# Altium project SelfDrivingCar_Project.PrjPcb (part 1 of 2)
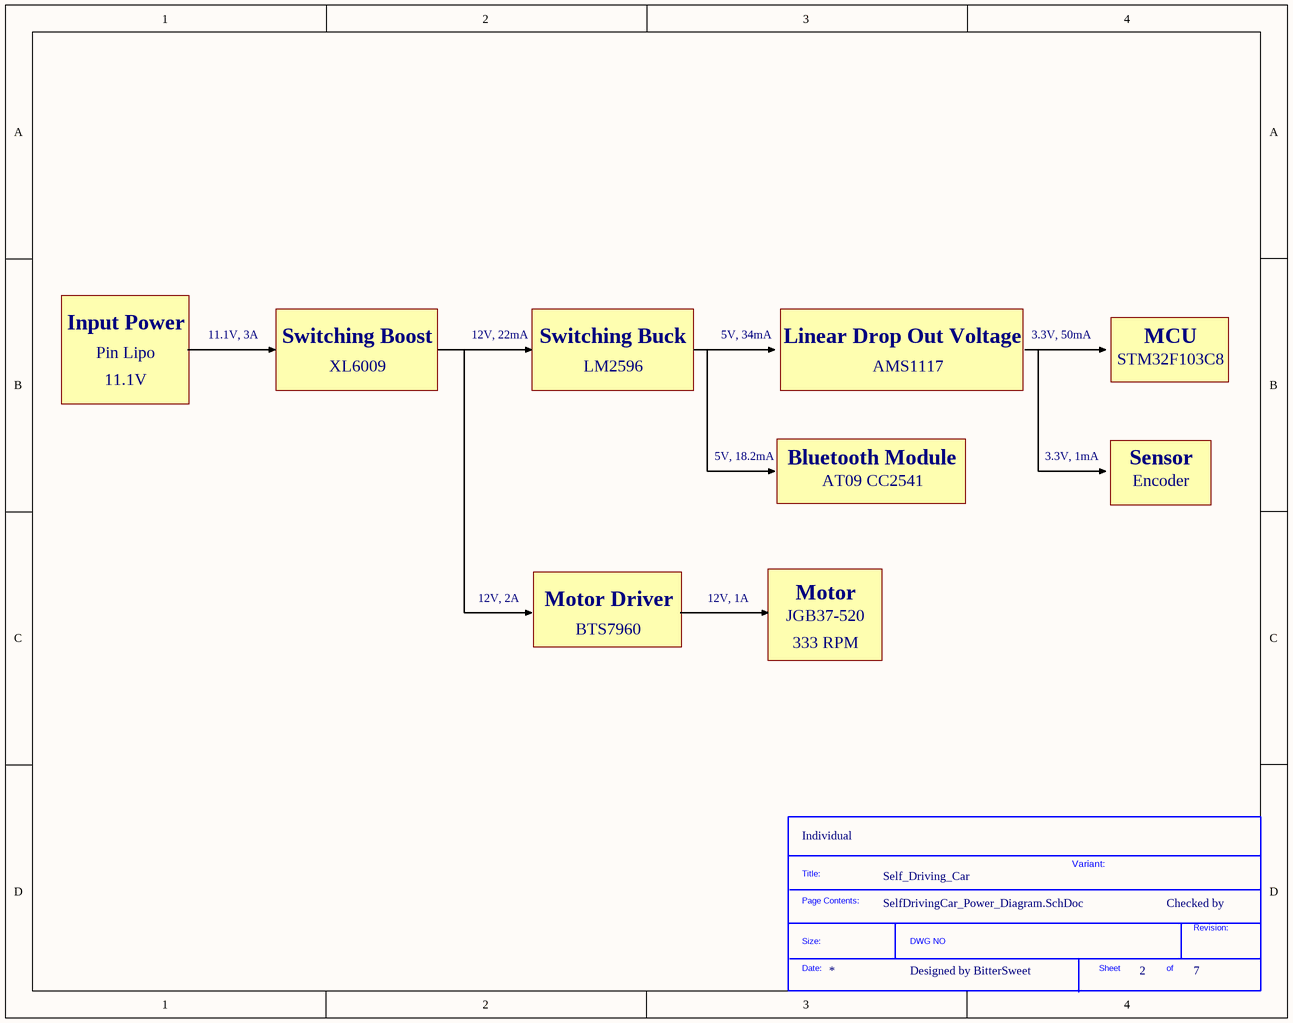
[diagram p0: SelfDrivingCar_Power_Diagram.SchDoc]
6 sheets, 141 parts. Net scope: flat (ports and power ports of the same name join across sheets).
Board file: SelfDrivingCar_PCB.PcbDoc
Sheets:
  SelfDrivingCar_Power_Diagram.SchDoc
  SelfDrivingCar_SCH_PowerBoard.SchDoc
  SelfDrivingCar_SCH_STM32F103C8T6.SchDoc
  SelfDrivingCar_SCH_MotorDriver.SchDoc
  SelfDrivingCar_SCH_Others.SchDoc
  SelfDrivingCar_SCH_Total.SchDoc

## Sheet SelfDrivingCar_Power_Diagram.SchDoc
size A; DocumentNumber: 3; SheetNumber: 2; SheetTotal: 7

### Parts
(Parts that share a designator on the sheet are numbered #1, #2 ... from top to bottom, then left to right.)
*?#1  SDTitleBlock  (value not drawn)  (graphical)

### Notes on the sheet
- Input Power
- Pin Lipo
- 11.1V, 3A
- Switching Boost
- XL6009
- 12V, 22mA
- Switching Buck
- LM2596
- 5V, 34mA
- Linear Drop Out Voltage
- AMS1117
- 3.3V, 50mA
- STM32F103C8
- MCU
- 11.1V
- 5V, 18.2mA
- Bluetooth Module
- AT09 CC2541
- 3.3V, 1mA
- Sensor
- Encoder
- 12V, 2A
- Motor Driver
- BTS7960
- 12V, 1A
- JGB37-520
- Motor
- 333 RPM
- (near *?#1) Individual
- Self_Driving_Car
- Variant:
- Checked by
- Designed by BitterSweet
- (in symbol SDTitleBlock) Title:; Page Contents:; Revision:; Size:; DWG NO; Date:; Sheet; of

## Sheet SelfDrivingCar_SCH_PowerBoard.SchDoc: Power Distribution Schematic
size A; DocumentNumber: Power Distribution Schematic; SheetNumber: 3; SheetTotal: 7
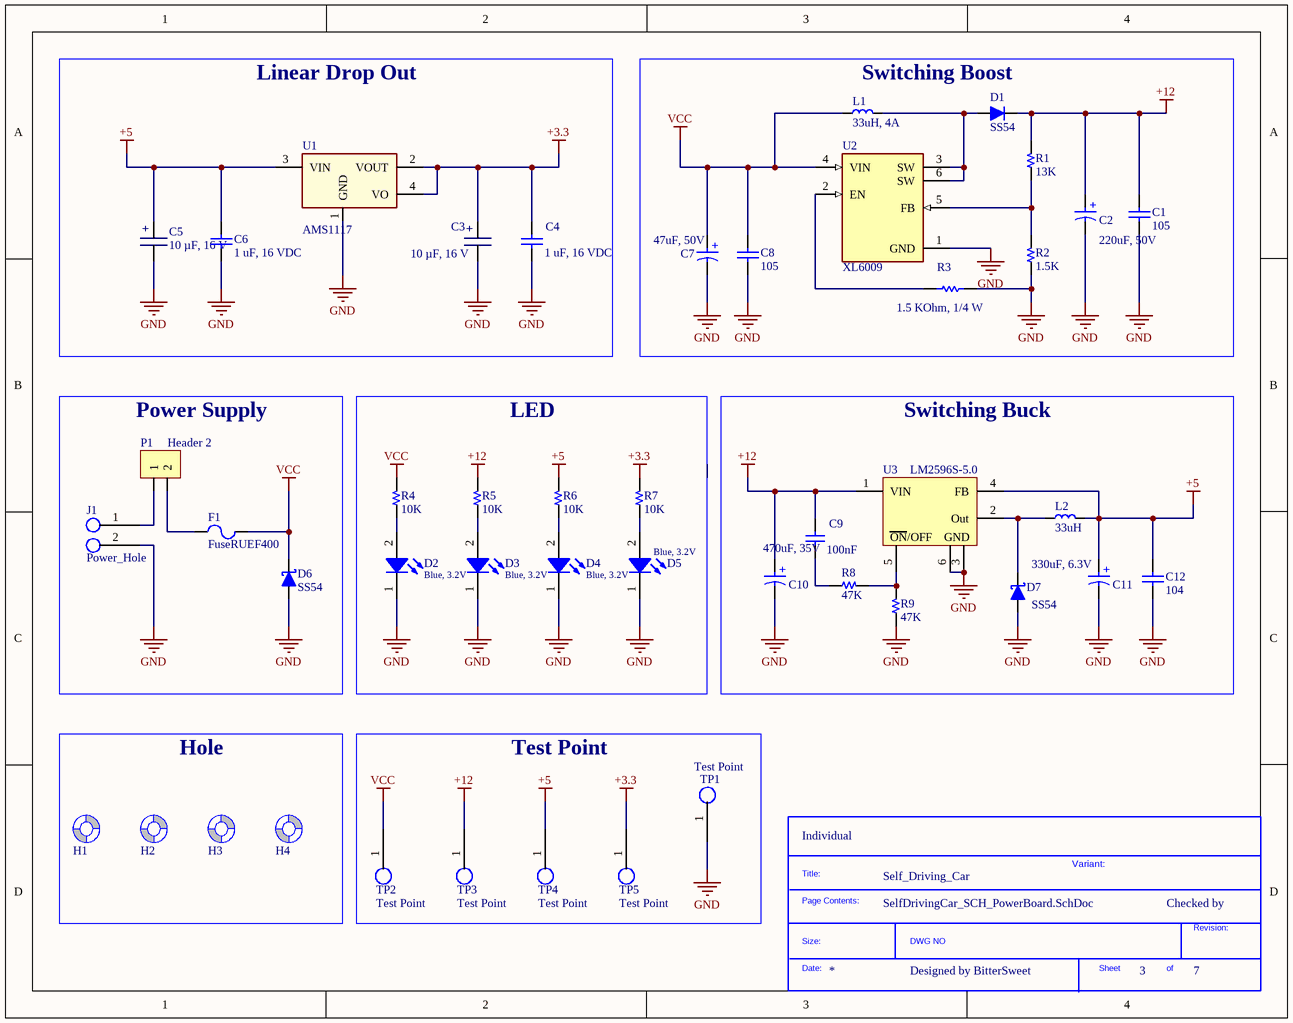
[diagram p1: SelfDrivingCar_SCH_PowerBoard.SchDoc]

### Parts
(Parts that share a designator on the sheet are numbered #1, #2 ... from top to bottom, then left to right.)
*?#2  SDTitleBlock  (value not drawn)  (graphical)
C1  105  [tu 1206]
C2  220uF, 50V  [WCAP-ASLI_D10H10.5]
C3  10 µF, 16 V  [TANTALUM SMD A]
C4  1 uF, 16 VDC  [CAP_0603]
C5  10 µF, 16 V  [TANTALUM SMD A]
C6  1 uF, 16 VDC  [CAP_0603]
C7  47uF, 50V  [WCAP-ASLI_D6.3H7.7]
C8  105  [tu 1206]
C9  100nF  [C 0805]
C10  470uF, 35V  [WCAP-ASLI_D10H10.5]
C11  330uF, 6.3V  [WCAP-ASLI_D6.3H7.7]
C12  104  [tu 0805]
D1  SS54  [DO-214AB (SMC)]
D2  Blue, 3.2V  [WL-SMCW_0805]
D3  Blue, 3.2V  [WL-SMCW_0805]
D4  Blue, 3.2V  [WL-SMCW_0805]
D5  Blue, 3.2V  [WL-SMCW_0805]
D6  SS54  [DO-214AC (SMA)]
D7  SS54  [DO-214AC (SMA)]
F1  FuseRUEF400  [FuseRUEF400]
H1  Screw Hole  [SCREW/3.2/7.0/M]  (value not drawn)  (no BOM)
H2  Screw Hole  [SCREW/3.2/7.0/M]  (value not drawn)  (no BOM)
H3  Screw Hole  [SCREW/3.2/7.0/M]  (value not drawn)  (no BOM)
H4  Screw Hole  [SCREW/3.2/7.0/M]  (value not drawn)  (no BOM)
J1  Power_Hole  [Power_Hole_2mm_THT]
L1  33uH, 4A  [Inductor SMD 12x12x8]
L2  33uH  [Inductor SMD 12x12x8]
P1  Header 2  [HDR/Terminal/2/3.5mm]
R1  13K  [R 0603]
R2  1.5K  [R 0603]
R3  1.5 KOhm, 1/4 W  [resistor_0603]
R4  10K  [R 0603]
R5  10K  [R 0603]
R6  10K  [R 0603]
R7  10K  [R 0603]
R8  47K  [R 0603]
R9  47K  [R 0603]
TP1  Test Point  [TP_1_5mm_SMD]
TP2  Test Point  [TP_1_5mm_SMD]
TP3  Test Point  [TP_1_5mm_SMD]
TP4  Test Point  [TP_1_5mm_SMD]
TP5  Test Point  [TP_1_5mm_SMD]
U1  AMS1117  [SOT-223]
U2  XL6009  [XL6009]
U3  LM2596S-5.0  [TO-263-5]

### Blocks framed on the sheet
Linear Drop Out: C3-C6 U1
Switching Boost: C1 C2 C7 C8 D1 L1 R1-R3 U2
Power Supply: D6 F1 J1 P1
LED: D2-D5 R4-R7
Switching Buck: C9-C12 D7 L2 R8 R9 U3
Hole: H1-H4
Test Point: TP1-TP5

### Nets
+3.3: C3.2 C4.2 R7.2 TP5.1 U1.2(VOUT) U1.4(VO)
+5: C5.2 C6.2 C11.1(P) C12.1 L2.2 R6.2 TP4.1 U1.3(VIN) U3.4(FB)
+12: C1.1 C2.1(P) C9.1 C10.1(P) D1.2(K) R1.2 R5.2 TP3.1 U3.1(VIN)
GND: C1.2 C2.2(N) C3.1 C4.1 C5.1 C6.1 C7.2(N) C8.2 C10.2(N) C11.2(N) C12.2 D2.1(K) D3.1(K) D4.1(K) D5.1(K) D6.1(A) D7.1(A) J1.2 R2.1 R3.2 R9.1 TP1.1 U1.1(GND) U2.1(GND) U3.3(GND) U3.6(PAD)
VCC: C7.1(P) C8.1 D6.2(K) F1.2 L1.1 R4.2 TP2.1 U2.4(VIN)
NetC9_2: C9.2 R8.1
NetD1_1: D1.1(A) L1.2 U2.3(SW) U2.6(SW)
NetD2_2: D2.2(A) R4.1
NetD3_2: D3.2(A) R5.1
NetD4_2: D4.2(A) R6.1
NetD5_2: D5.2(A) R7.1
NetD7_2: D7.2(K) L2.1 U3.2(Out)
NetF1_1: F1.1 P1.2
NetJ1_1: J1.1 P1.1
NetR1_1: R1.1 R2.2 U2.5(FB)
NetR3_1: R3.1 U2.2(EN)
NetR8_2: R8.2 R9.2 U3.5(~{ON}/OFF)

Not connected (* = marked no-connect by the designer): H1 1(Screw); H2 1(Screw); H3 1(Screw); H4 1(Screw)

### Notes on the sheet
- (near *?#2) Individual
- Self_Driving_Car
- Variant:
- Checked by
- Designed by BitterSweet
- (in symbol 01120610610) +
- (in symbol 865080145010) +
- (in symbol 865080645012) +
- (in symbol 865080657018) +
- (in symbol 0710101508650801570160U20) +
- (in symbol LM2596S-5.0) ON/OFF
- (in symbol SDTitleBlock) Title:; Page Contents:; Revision:; Size:; DWG NO; Date:; Sheet; of

### Library data of the parts
C1 C8 = Tu 1206 105 50V 20%: Dán; Don_Vi: Con; So_Chan: 2; Ten_Linh_Kien: Tụ 1206 105-1uF 10% 16V; Ma_Hang: MH004545; Chung_Loai: Dán; Kieu_Chan: *; ComponentLink1Description: URL; ComponentLink1URL: https://www.thegioiic.com/tu-gom-1206-1uf-16v; SUPPLIER NAME: JLCPCB; SUPPLIER SN: C141215; SUPPLIER URL: https://jlcpcb.com/partdetail/Kemet-C1206X105K5RAC7800/C141215
C2 = 865080657018: V-Chip, D10 x H10.5mm, 220uF, 50V; Manufacturer: Wurth Elektronik; Capacitance Tolerance: +/-20%; Dissipation Factor: 12%; Endurance: 2000h; Leakage Current: 110uA; Ripple Current: 650mA; Category: Aluminum Electrolytic Capacitors; ComponentLink2Description: Datasheet Link; ComponentLink2URL: https://www.we-online.com/redexpert/spec/865080657018?ad; Mount: Surface Mount; Operating Temperature Max: 105°C; Operating Temperature Min: -55°C; Packaging: Tape and Reel; Height: 10.5mm; Diameter: 10mm; Capacitance: 220uF; Rated Voltage (DC): 50V; Supplier 1 Name: Mouser; Supplier 1 SN: 710-865080657018; Supplier 1 URL: https://www.mouser.vn/ProductDetail/Wurth-Elektronik/865080657018?qs=0KOYDY2FL28CcgHzg1XTuA%3D%3D; Supplier 3 Name: thegioiic; Supplier 3 URL: https://www.thegioiic.com/tu-nhom-smd-220uf-50v-10x10-5mm; Manufacturer Part Number: N/A; Supplier 2 Name: Digi-Key; Supplier 2 SN: N/A; Supplier 2 URL: N/A; Supplier 3 SN: N/A; Value: 220uF, 50V; ComponentLink3Description: URL; ComponentLink3URL: https://www.thegioiic.com/tu-nhom-smd-220uf-50v-10x10-5mm; SUPPLIER NAME: JLCPCB; SUPPLIER SN: C5289735; SUPPLIER URL: https://jlcpcb.com/partdetail/aishi_aihua_group-EMK1HM221GB0D00R/C5289735
C3 C5 = 01120610610: CAP TANT 10uF 10% 16V 1206; Manufacture  Name: KYOCERA AVX; Manufacture  SN: TPSA106K016R1000; Capacitance Tolerance: +/-10%; ComponentLink1Description: Datasheet link; ComponentLink1URL: https://datasheets.kyocera-avx.com/TAJ.pdf; ComponentLink2Description: Supplier 1 URL; ComponentLink2URL: https://www.mouser.vn/ProductDetail/KYOCERA-AVX/TPSA106K016R1000?qs=GLv2FRWg8zkKT7IxHlCjvQ%3D%3D; Size: 1206; Mounting Technology: SMT; Capacitance: 10uF; ComponentLink3Description: Supplier 2 URL; ComponentLink3URL: https://www.digikey.com/en/products/detail/kyocera-avx/TPSA106K016R1000/7536120; ComponentLink4Description: Supplier 3 URL; ComponentLink4URL: https://www.thegioiic.com/tu-tantalum-10uf-16v-1206-taja106k016rnj; Supplier 1 Name: Mouser; Supplier 1 SN: 581-TPSA106K016R1000; Supplier 1 URL: https://www.mouser.vn/ProductDetail/KYOCERA-AVX/TPSA106K016R1000?qs=GLv2FRWg8zkKT7IxHlCjvQ%3D%3D; Supplier 2 Name: Digi-Key; Supplier 2 SN: 478-10757-1-ND; Supplier 2 URL: https://www.digikey.com/en/products/detail/kyocera-avx/TPSA106K016R1000/7536120; Supplier 3 Name: thegioiic; Supplier 3 SN: N/A; Supplier 3 URL: https://www.thegioiic.com/tu-tantalum-10uf-16v-1206-taja106k016rnj; Value: 10 µF, 16 V; Rated Voltage: 16 V; ComponentLink5Description: URL; ComponentLink5URL: https://www.thegioiic.com/tu-tantalum-10uf-16v-1206-taja106k016rnj; SUPPLIER NAME: JLCPCB; SUPPLIER SN: C128857; SUPPLIER URL: https://jlcpcb.com/partdetail/Yageo-CC1206KKX5R7BB106/C128857
C4 C6 = 0106031051016: CAP, size 0603, 1 uF, 16 VDC; Manufacture Name: Samsung Electro-Mechanics; Manufacture SN: CL10B105KO8NNWC; Capacitance: 1 uF; Tolerance: +/-10%; Voltage Rating DC: 16 VDC; ComponentLink2Description: Datasheet; ComponentLink2URL: https://www.mouser.vn/datasheet/2/585/Samsung_MLCC_1837944-1929650.pdf; Operating Temperature: -55 to +125degC; Packaging: Tape and Reel; Mounting Technology: SMT; Size: 0603; Supplier 1 Name: Mouser; Supplier 1 SN: 187-CL10B105KO8NNWC; Supplier 1 URL: https://www.mouser.vn/ProductDetail/Samsung-Electro-Mechanics/CL10B105KO8NNWC?qs=81r%252BiQLm7BT%252BXtc72qn1ug%3D%3D&utm_source=mouser-refine-download&utm_medium=file&utm_campaign=CL10B105KO8NNWC&utm_content=Samsung-Electro-Mechanics; Supplier 2 Name: Digi-Key; Supplier 2 SN: 1276-CL10B105KO8NNWCTR-ND; Supplier 2 URL: https://www.digikey.com/en/products/detail/samsung-electro-mechanics/cl10b105ko8nnwc/16572783; Supplier 3 Name: thegioiic; Supplier 3 SN: N/A; Supplier 3 URL: https://www.thegioiic.com/tu-gom-0603-1uf-16v; Value: 1 uF, 16 VDC; SUPPLIER NAME: JLCPCB; SUPPLIER SN: C76706; SUPPLIER URL: https://jlcpcb.com/partdetail/Tdk-CGA3E1X7R1C105KT0Y0N/C76706
C7 = 865080645012: V-Chip, D6.3 x H7.7mm, 47uF, 50V; Manufacturer: Wurth Elektronik; Capacitance Tolerance: +/-20%; Dissipation Factor: 12%; Endurance: 2000h; Leakage Current: 23.5uA; Ripple Current: 230mA; Category: Aluminum Electrolytic Capacitors; ComponentLink2Description: Datasheet Link; ComponentLink2URL: https://www.thegioiic.com/tu-nhom-smd-47uf-50v-6-3x7-7mm; Mount: Surface Mount; Operating Temperature Max: 105°C; Operating Temperature Min: -55°C; Packaging: Tape and Reel; Height: 7.7mm; Diameter: 6.3mm; Capacitance: 47uF; Rated Voltage (DC): 50V; Supplier 1 Name: Mouser; Supplier 1 SN: 710-865080645012; Supplier 1 URL: https://www.mouser.vn/ProductDetail/Wurth-Elektronik/865080645012?qs=0KOYDY2FL2%252BvvLOdOSK4rA%3D%3D&_gl=1*1ey7vig*_ga*MTg2NTM2NjU1Mi4xNjkwOTM2MTU0*_ga_15W4STQT4T*MTY5MDkzNjE1NC4xLjAuMTY5MDkzNjE1Ny4wLjAuMA..*_ga_1KQLCYKRX3*MTY5MDkzNjE1NC4xLjAuMTY5MDkzNjE1Ny41Ny4wLjA.; Supplier 3 Name: thegioiic; Supplier 3 URL: https://www.thegioiic.com/tu-nhom-smd-47uf-50v-6-3x7-7mm; Manufacturer Part Number: N/A; Supplier 2 Name: Digi-Key; Supplier 2 SN: N/A; Supplier 2 URL: N/A; Supplier 3 SN: N/A; Value: 47uF, 50V; ComponentLink3Description: URL; ComponentLink3URL: https://www.thegioiic.com/tu-nhom-smd-47uf-50v-6-3x7-7mm; SUPPLIER NAME: JLCPCB; SUPPLIER SN: C445256; SUPPLIER URL: https://jlcpcb.com/partdetail/Nichicon-UUD1H470MCL1GS/C445256
C9 = Capacitor NP: Capacitor non-pol; ComponentLink1Description: URL; ComponentLink1URL: https://www.thegioiic.com/tu-gom-0603-100nf-0-1uf-50v; SUPPLIER NAME: JLCPCB; SUPPLIER SN: C779984; SUPPLIER URL: https://jlcpcb.com/partdetail/-08055C104K4Z2A/C779984
C10 = 0710101508650801570160U20: V-Chip, D10 x H10.5mm, 470uF, 35V; Manufacturer: Wurth Elektronik; Capacitance Tolerance: +/-20%; Dissipation Factor: 24%; Endurance: 2000h; Leakage Current: 94.5uA; Rated Voltage (DC): 6.3V; Ripple Current: 650mA; Category: Aluminum Electrolytic Capacitors; ComponentLink2Description: Datasheet Link; ComponentLink2URL: https://www.we-online.com/redexpert/spec/865080157016?ad; Mount: Surface Mount; Operating Temperature Max: 105°C; Operating Temperature Min: -55°C; Packaging: Tape and Reel; Height: 10.5mm; Diameter: 10mm; Capacitance: 470uF; Supplier 1 Name: Mouser; Supplier 1 SN: 710-865080157016; Supplier 1 URL: https://www.mouser.vn/ProductDetail/Wurth-Elektronik/865080157016?qs=0KOYDY2FL29k8EDLGk1i5Q%3D%3D; Supplier 3 Name: thegioiic; Supplier 3 URL: https://www.mouser.vn/ProductDetail/Wurth-Elektronik/865080157016?qs=0KOYDY2FL29k8EDLGk1i5Q%3D%3D; Manufacturer Part Number: N/A; Supplier 2 Name: Digi-Key; Supplier 2 SN: N/A; Supplier 2 URL: https://www.thegioiic.com/tu-nhom-smd-470uf-35v-10x10-5mm; Supplier 3 SN: N/A; Value: 470uF, 35V; SUPPLIER NAME: JLCPCB; SUPPLIER SN: C3039779; SUPPLIER URL: https://jlcpcb.com/partdetail/3595245-VT477M035GA5RR0NB1VP0/C3039779
C11 = 865080145010: V-Chip, D6.3 x H7.7mm, 330uF, 16V; Manufacturer: Wurth Elektronik; Capacitance Tolerance: +/-20%; Dissipation Factor: 24%; Endurance: 2000h; Leakage Current: 20.79uA; Ripple Current: 275mA; Manufacturer Part Number: 865080145010; Category: Aluminum Electrolytic Capacitors; ComponentLink2Description: Datasheet Link; ComponentLink2URL: https://www.we-online.com/redexpert/spec/865080145010?ad; Mount: Surface Mount; Operating Temperature Max: 105°C; Operating Temperature Min: -55°C; Packaging: Tape and Reel; Height: 7.7mm; Diameter: 6.3mm; Capacitance: 330uF; Rated Voltage (DC): 16V; Supplier 1 Name: Mouser; Supplier 1 SN: 710-865080145010; Supplier 1 URL: https://www.mouser.vn/ProductDetail/Wurth-Elektronik/865080145010?qs=0KOYDY2FL2%252B70aKe3MLQSg%3D%3D; Supplier 3 Name: thegioiic; Supplier 3 URL: https://www.thegioiic.com/tu-nhom-smd-330uf-6-3v-6-3x7-7mm; Supplier 2 Name: Digi-Key; Supplier 2 SN: N/A; Supplier 2 URL: N/A; Supplier 3 SN: N/A; Value: 330uF, 16V; SUPPLIER NAME: JLCPCB; SUPPLIER SN: C962163; SUPPLIER URL: https://jlcpcb.com/partdetail/1043489-EMZR160ARA331MF80G/C962163
C12 = Tu 0805 104 50V 10%: Dán; Don_Vi: Con; So_Chan: 2; Ten_Linh_Kien: Tụ 0805 104-100nF 10% 50V; Ma_Hang: MH004551; Chung_Loai: Dán; Kieu_Chan: *; ComponentLink1Description: URL; ComponentLink1URL: https://www.thegioiic.com/tu-gom-0805-100nf-0-1uf-50v; SUPPLIER NAME: JLCPCB; SUPPLIER SN: C840115; SUPPLIER URL: https://jlcpcb.com/partdetail/HuiJu-NL0805B104J500CPBN/C840115
D1 = Diode: SS54 SMC Diode Schottky 5A 40V; ComponentLink1Description: URL; ComponentLink1URL: https://www.thegioiic.com/ss54-smc-diode-schottky-5a-40v; SUPPLIER SN: *; SUPPLIER NAME: JLCPCB; SUPPLIER URL: *
D2-D5 = 160805BlueClear: WL-SMCW SMT Mono-color Chip LED Waterclear, size 0805, Blue, 3.2V, 140deg; Type: Clear; Color: Blue; Size: 0603; ComponentLink1Description: Datasheet link; ComponentLink1URL: N/A; ComponentLink2Description: Supplier 1 URL; ComponentLink2URL: https://www.mouser.vn/ProductDetail/Wurth-Elektronik/150080BS75000?qs=2kOmHSv6VfT2tBo3UPVqAQ%3D%3D; ComponentLink3Description: Supplier 2 URL; ComponentLink3URL: https://www.digikey.com/en/products/detail/liteon/LTST-C170TBKT/388527; ComponentLink4Description: Supplier 3 URL; ComponentLink4URL: https://www.thegioiic.com/led-xanh-duong-0805-dan-smd-trong-suot-harvatek; Supplier 1 Name: Mouser; Supplier 1 SN: 710-150080BS75000; Supplier 1 URL: https://www.mouser.vn/ProductDetail/Wurth-Elektronik/150080BS75000?qs=2kOmHSv6VfT2tBo3UPVqAQ%3D%3D; Supplier 2 Name: Digi-Key; Supplier 2 SN: 160-1579-2-ND; Supplier 2 URL: https://www.digikey.com/en/products/detail/liteon/LTST-C170TBKT/388527; Supplier 3 Name: ICDayRoi; Supplier 3 SN: N/A; Supplier 3 URL: https://www.thegioiic.com/led-xanh-duong-0805-dan-smd-trong-suot-harvatek; Value: Blue, 3.2V; SUPPLIER NAME: JLCPCB; SUPPLIER SN: *; SUPPLIER URL: *
D6 D7 = Diode Schottky: Schottky Diode; SUPPLIER SN: *; SUPPLIER NAME: JLCPCB; ComponentLink1Description: URL; ComponentLink1URL: https://www.thegioiic.com/ss54-sma-diode-shotky-5a-40v; SUPPLIER URL: *
F1 = FuseRUEF400: RUEF400 30V 4A; SUPPLIER SN: *; SUPPLIER NAME: JLCPCB; SUPPLIER URL: *
J1 = Power_Hole: Power Hole, THT
L1 L2 = Inductor: ComponentLink1Description: URL; ComponentLink1URL: https://www.thegioiic.com/cdrh127-cuon-cam-dan-smd-1280-330-33uh-4-2a; SUPPLIER NAME: JLCPCB; SUPPLIER SN: *; SUPPLIER URL: *
P1 = Header 2: Header, 2-Pin; ComponentLink1Description: URL; ComponentLink1URL: https://www.thegioiic.com/kf128-2-v-domino-2-chan-thang-3-5mm-300v-10a-han-pcb
R1 R2 R4-R9 = Resistor: ComponentLink1Description: URL; SUPPLIER NAME: JLCPCB
  R1: ComponentLink1URL: https://www.thegioiic.com/dien-tro-13-kohm-0603-1-; SUPPLIER SN: C365383; SUPPLIER URL: https://jlcpcb.com/partdetail/Resi-ETCR0603F13K0K9/C365383
  R2: ComponentLink1URL: https://www.thegioiic.com/dien-tro-1-5-kohm-0603-1-; SUPPLIER SN: C445824; SUPPLIER URL: https://jlcpcb.com/partdetail/Panasonic-ERJPA3J152V/C445824
  R4-R7: ComponentLink1URL: https://www.thegioiic.com/dien-tro-10-kohm-0603-1-; SUPPLIER SN: C2989345; SUPPLIER URL: https://jlcpcb.com/partdetail/3448768-TC0325D1002T5F/C2989345
  R8 R9: ComponentLink1URL: https://www.thegioiic.com/dien-tro-47-kohm-0603-1-; SUPPLIER SN: *; SUPPLIER URL: *
R3 = 0006031525: RES, size 0603, 1.5 KOhm, 1/4 W; Manufacture  Name: Panasonic; Rated Power: 1/4 W; Resistance Tolerance: +/-5%; Size: 0603; Mounting Technology: SMT; Resistance: 1.5 KOhm; Supplier 1 Name: Mouser; Supplier 1 SN: 667-ERJ-PA3J152V; Supplier 1 URL: https://www.mouser.vn/ProductDetail/Panasonic/ERJ-PA3J152V?qs=BzJM0faLVqVoRX2ZXjooUw%3D%3D; Supplier 2 Name: Digi-Key; Supplier 2 SN: P1.5KBZTR-ND - Tape & Reel (TR); Supplier 3 Name: thegioiic; Supplier 3 SN: N/A; Supplier 3 URL: https://www.thegioiic.com/dien-tro-1-5-kohm-0603-1-; Manufacture  SN: https://www.mouser.vn/ProductDetail/Panasonic/ERJ-PA3J152V?qs=BzJM0faLVqVoRX2ZXjooUw%3D%3D; Value: 1.5 KOhm, 1/4 W; ComponentLink1Description: Datasheet link; ComponentLink1URL: https://www.mouser.vn/datasheet/2/315/Panasonic_Resistors_Thick_Film_Anti_Sulf_Anti_Surg-1825099.pdf; ComponentLink2Description: Supplier 1 URL; ComponentLink2URL: N/A; ComponentLink3Description: Supplier 2 URL; ComponentLink3URL: https://www.digikey.com/en/products/detail/panasonic-electronic-components/ERJ-PA3J152V/5035991?s=N4IgTCBcDaIGxwOwFoCiAlAUsgCgQQGZMBGAVjADUQBdAXyA; ComponentLink4Description: Supplier 3 URL; ComponentLink4URL: N/A; Supplier 2 URL: https://www.digikey.com/en/products/detail/panasonic-electronic-components/ERJ-PA3J152V/5035991?s=N4IgTCBcDaIGxwOwFoCiAlAUsgCgQQGZMBGAVjADUQBdAXyA; SUPPLIER NAME: JLCPCB; SUPPLIER SN: C445824; SUPPLIER URL: https://jlcpcb.com/partdetail/Panasonic-ERJPA3J152V/C445824
U1 = AMS1117: 1A LDO Voltage Regulator, ADJ or fixed 1.5/1.8/2.5/2.85/3.3/5V; SUPPLIER NAME: JLCPCB; SUPPLIER SN: C6186; SUPPLIER URL: https://jlcpcb.com/partdetail/Advanced_MonolithicSystems-AMS1117_33/C6186
U2 = XL6009: IC switching boost voltage; ComponentLink1Description: URL; ComponentLink1URL: https://www.thegioiic.com/xl6009-ic-dieu-chinh-tang-ap-5a-to-263-5; SUPPLIER NAME: JLCPCB; SUPPLIER URL: *
U3 = LM2596S-5.0: Simple Switcher 3A Step-Down Voltage Regulator; ComponentLink1Description: URL; ComponentLink1URL: https://www.thegioiic.com/lm2596s-5-0-ic-dieu-chinh-giam-ap-5v-3a-to-263-5; ComponentLink2Description: New link; ComponentLink2URL: *; SUPPLIER NAME: JLCPCB; SUPPLIER SN: C347421; SUPPLIER URL: https://jlcpcb.com/partdetail/324081-LM2596S_50/C347421
H1-H4 = Screw Hole: TYPE: NO-BOM; UNIT PRICE: 0

## Sheet SelfDrivingCar_SCH_STM32F103C8T6.SchDoc
size A; DocumentNumber: 5; SheetNumber: 4; SheetTotal: 7
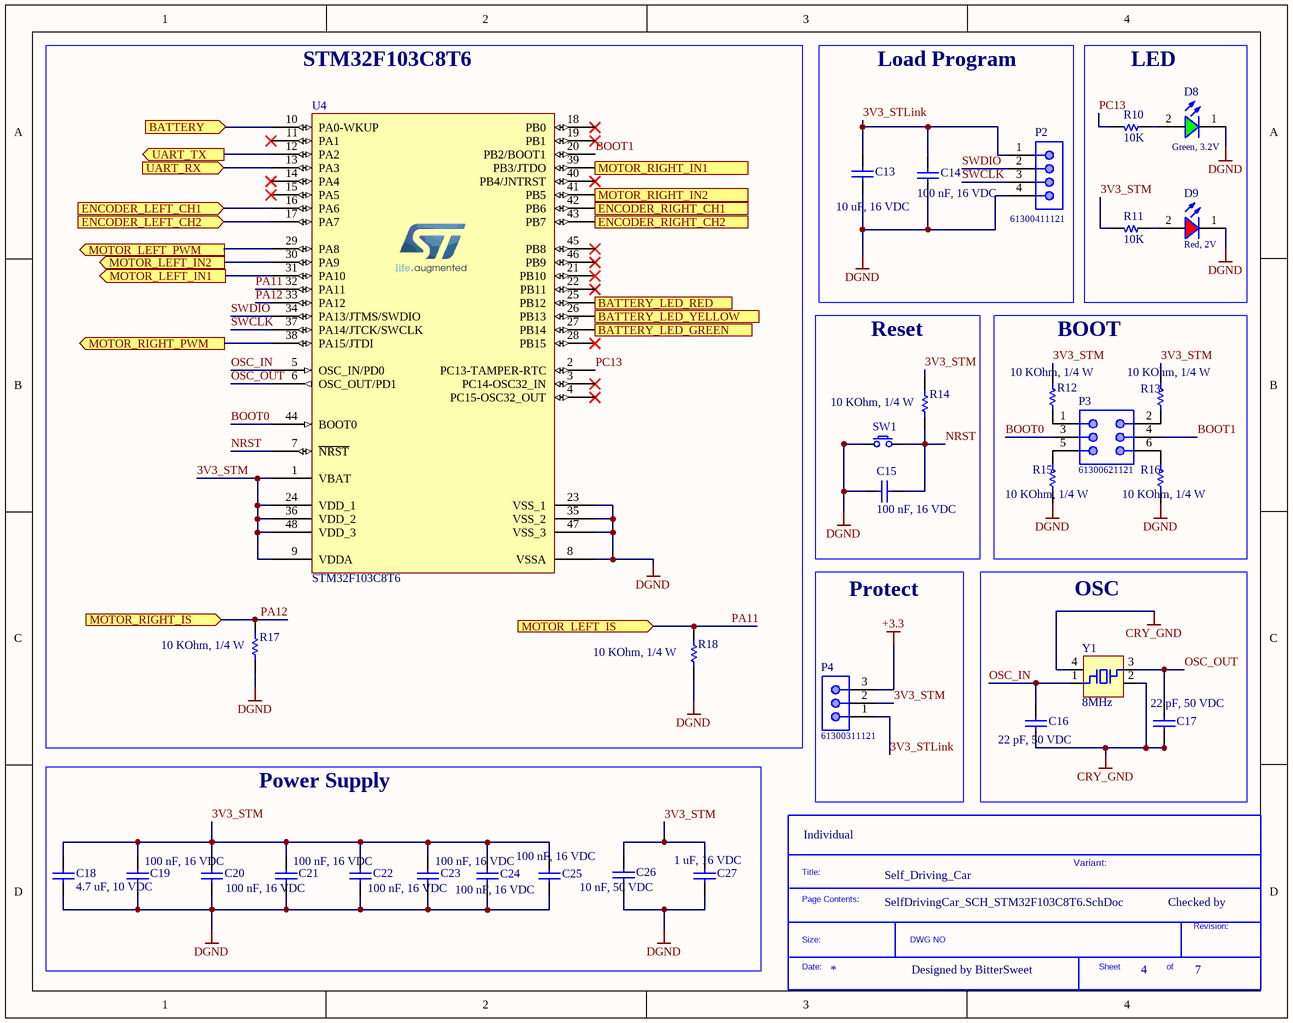
[diagram p2: SelfDrivingCar_SCH_STM32F103C8T6.SchDoc]

### Parts
(Parts that share a designator on the sheet are numbered #1, #2 ... from top to bottom, then left to right.)
*?#3  SDTitleBlock  (value not drawn)  (graphical)
C13  10 uF, 16 VDC  [CAP_0603]
C14  100 nF, 16 VDC  [CAP_0603]
C15  100 nF, 16 VDC  [CAP_0603]
C16  22 pF, 50 VDC  [CAP_0603]
C17  22 pF, 50 VDC  [CAP_0603]
C18  4.7 uF, 10 VDC  [CAP_0603]
C19  100 nF, 16 VDC  [CAP_0603]
C20  100 nF, 16 VDC  [CAP_0603]
C21  100 nF, 16 VDC  [CAP_0603]
C22  100 nF, 16 VDC  [CAP_0603]
C23  100 nF, 16 VDC  [CAP_0603]
C24  100 nF, 16 VDC  [CAP_0603]
C25  100 nF, 16 VDC  [CAP_0603]
C26  10 nF, 50 VDC  [CAP_0603]
C27  1 uF, 16 VDC  [CAP_0603]
D8  Green, 3.2V  [WL-SMCW_0603_H=0.7mm]
D9  Red, 2V  [WL-SMCW_0603_H=0.7mm]
P2  61300411121  [61300411121]
P3  61300621121  [61300621121]
P4  61300311121  [61300311121]
R10  10K  [R 0603]
R11  10K  [R 0603]
R12  10 KOhm, 1/4 W  [resistor_0603]
R13  10 KOhm, 1/4 W  [resistor_0603]
R14  10 KOhm, 1/4 W  [resistor_0603]
R15  10 KOhm, 1/4 W  [resistor_0603]
R16  10 KOhm, 1/4 W  [resistor_0603]
R17  10 KOhm, 1/4 W  [resistor_0603]
R18  10 KOhm, 1/4 W  [resistor_0603]
SW1  ?  [Button]  (value not drawn)
U4  STM32F103C8T6  [STM32F103C8T6]
Y1  8MHz  [Crystal SMD 4PIN 32x25]

### Blocks framed on the sheet
STM32F103C8T6: R17 R18 U4
Load Program: C13 C14 P2
LED: D8 D9 R10 R11
Reset: C15 R14 SW1
BOOT: P3 R12 R13 R15 R16
Protect: P4
OSC: C16 C17 Y1
Power Supply: C18-C27

### Ports
BATTERY (in), BATTERY_LED_GREEN (out), BATTERY_LED_RED (out), BATTERY_LED_YELLOW (out), ENCODER_LEFT_CH1 (in), ENCODER_LEFT_CH2 (in), ENCODER_RIGHT_CH1 (in), ENCODER_RIGHT_CH2 (in), MOTOR_LEFT_IN1 (out), MOTOR_LEFT_IN2 (out), MOTOR_LEFT_IS (in), MOTOR_LEFT_PWM (out), MOTOR_RIGHT_IN1 (out), MOTOR_RIGHT_IN2 (out), MOTOR_RIGHT_IS (in), MOTOR_RIGHT_PWM (out), UART_RX (in), UART_TX (out)

### Nets
+3.3: P4.3
CRY_GND: C16.1 C17.1 Y1.2(GND) Y1.4(GND)
DGND: C13.1 C14.1 C15.1 C18.1 C19.1 C20.1 C21.1 C22.1 C23.1 C24.1 C25.1 C26.1 C27.1 D8.1(K) D9.1(K) P2.4 R15.1 R16.1 R17.2 R18.1 SW1.1 U4.8(VSSA) U4.23(VSS_1) U4.35(VSS_2) U4.47(VSS_3)
3V3_STLink: C13.2 C14.2 P2.1 P4.1
3V3_STM: C18.2 C19.2 C20.2 C21.2 C22.2 C23.2 C24.2 C25.2 C26.2 C27.2 P4.2 R11.2 R12.2 R13.2 R14.2 U4.1(VBAT) U4.9(VDDA) U4.24(VDD_1) U4.36(VDD_2) U4.48(VDD_3)
BOOT0: P3.3 U4.44(BOOT0)
BOOT1: P3.4 U4.20(PB2/BOOT1)
NRST: C15.2 R14.1 SW1.2 U4.7(~{NRST})
OSC_IN: C16.2 U4.5(OSC_IN/PD0) Y1.1(XTAL)
OSC_OUT: C17.2 U4.6(OSC_OUT/PD1) Y1.3(XTAL)
PA11: R18.2 U4.32(PA11) ; port MOTOR_LEFT_IS
PA12: R17.1 U4.33(PA12) ; port MOTOR_RIGHT_IS
PC13: R10.2 U4.2(PC13-TAMPER-RTC)
SWCLK: P2.3 U4.37(PA14/JTCK/SWCLK)
SWDIO: P2.2 U4.34(PA13/JTMS/SWDIO)
NetC38_1: U4.10(PA0-WKUP) ; port BATTERY
NetD8_2: D8.2(A) R10.1
NetD9_2: D9.2(A) R11.1
NetP3_1: P3.1 R12.1
NetP3_2: P3.2 R13.1
NetP3_5: P3.5 R15.2
NetP3_6: P3.6 R16.2
NetP5_2: U4.13(PA3) ; port UART_RX
NetP5_3: U4.12(PA2) ; port UART_TX
NetP6_2: U4.17(PA7) ; port ENCODER_LEFT_CH2
NetP6_3: U4.16(PA6) ; port ENCODER_LEFT_CH1
NetP7_2: U4.43(PB7) ; port ENCODER_RIGHT_CH2
NetP7_3: U4.42(PB6) ; port ENCODER_RIGHT_CH1
NetR25_2: U4.38(PA15/JTDI) ; port MOTOR_RIGHT_PWM
NetR26_2: U4.29(PA8) ; port MOTOR_LEFT_PWM
NetR31_2: U4.27(PB14) ; port BATTERY_LED_GREEN
NetR33_2: U4.26(PB13) ; port BATTERY_LED_YELLOW
NetR35_2: U4.25(PB12) ; port BATTERY_LED_RED
NetU4_30: U4.30(PA9) ; port MOTOR_LEFT_IN2
NetU4_31: U4.31(PA10) ; port MOTOR_LEFT_IN1
NetU4_39: U4.39(PB3/JTDO) ; port MOTOR_RIGHT_IN1
NetU4_41: U4.41(PB5) ; port MOTOR_RIGHT_IN2

Not connected (* = marked no-connect by the designer): U4 3(PC14-OSC32_IN)* 4(PC15-OSC32_OUT)* 11(PA1)* 14(PA4)* 15(PA5)* 18(PB0)* 19(PB1)* 21(PB10)* 22(PB11)* 28(PB15)* 40(PB4/JNTRST)* 45(PB8)* 46(PB9)*

### Notes on the sheet
- (near *?#3) Individual
- Self_Driving_Car
- Variant:
- Checked by
- Designed by BitterSweet
- (in symbol SDTitleBlock) Title:; Page Contents:; Revision:; Size:; DWG NO; Date:; Sheet; of

### Library data of the parts
C13 = 0106031061010: CAP, size 0603, 10 uF, 16 VDC; Manufacture Name: Samsung Electro-Mechanics; Manufacture SN: CL10A106KP8NNWC; Capacitance: 10 uF; Tolerance: +/-10%; Voltage Rating DC: 16 VDC; ComponentLink2Description: Datasheet; ComponentLink2URL: https://www.mouser.vn/datasheet/2/585/MLCC-1837944.pdf; Operating Temperature: -55 to +125degC; Packaging: Tape and Reel; Mounting Technology: SMT; Size: 0603; Supplier 1 Name: Mouser; Supplier 1 SN: 187-CL10A106KP8NNWC; Supplier 1 URL: https://www.mouser.vn/ProductDetail/Samsung-Electro-Mechanics/CL10A106KP8NNWC?qs=xZ%2FP%252Ba9zWqZx8LSX23YqWA%3D%3D&utm_source=mouser-refine-download&utm_medium=file&utm_campaign=CL10A106KP8NNWC&utm_content=Samsung-Electro-Mechanics; Supplier 2 Name: Digi-Key; Supplier 2 SN: 1276-CL10A106KP8NNWCTR-ND; Supplier 2 URL: https://www.digikey.com/en/products/detail/samsung-electro-mechanics/cl10a106kp8nnwc/16572907; Supplier 3 Name: thegioiic; Supplier 3 SN: N/A; Supplier 3 URL: https://www.thegioiic.com/tu-gom-0603-10uf-16v; Value: 10 uF, 16 VDC; SUPPLIER NAME: JLCPCB; SUPPLIER SN: C703132; SUPPLIER URL: https://jlcpcb.com/partdetail/738561-GRM188R61C106MAALD/C703132
C14 C15 C19-C25 = 0106031041050: CAP, size 0603, 100 nF, 16 VDC; Manufacture Name: TDK; Manufacture SN: CGA3E3X8R1H104K080AE; Capacitance: 100 nF; Tolerance: +/-10%; Voltage Rating DC: 16 VDC; ComponentLink2Description: Datasheet; ComponentLink2URL: https://product.tdk.com/system/files/dam/doc/product/capacitor/ceramic/mlcc/catalog/mlcc_automotive_soft_en.pdf?ref_disty=mouser; Operating Temperature: -55 to +125degC; Packaging: Tape and Reel; Mounting Technology: SMT; Size: 0603; Supplier 1 Name: Mouser; Supplier 1 SN: 810-CGA3E3X8R1H104KA; Supplier 1 URL: https://www.mouser.com/ProductDetail/TDK/CGA3E3X8R1H104K080AE?qs=nQSIdc08i%252Bd8g3IRRgU2bw%3D%3D&utm_source=mouser-refine-download&utm_medium=file&utm_campaign=CGA3E3X8R1H104K080AE&utm_content=TDK; Supplier 2 Name: Digi-Key; Supplier 2 SN: 445-173697-2-ND; Supplier 2 URL: https://www.digikey.com/en/products/detail/tdk-corporation/cga3e3x8r1h104k080ae/5809262; Supplier 3 Name: thegioiic; Supplier 3 SN: N/A; Supplier 3 URL: https://www.thegioiic.com/tu-gom-0603-100nf-0-1uf-16v; Value: 100 nF, 16 VDC; SUPPLIER NAME: JLCPCB; SUPPLIER SN: C525499; SUPPLIER URL: https://jlcpcb.com/partdetail/Walsin_TechCorp-0603B104J160CT/C525499
C16 C17 = 0106032200550: CAP, size 0603, 22 pF, 50 VDC; Manufacture Name: TDK; Manufacture SN: CGA3E2NP01H220J080AA; Capacitance: 22 pF; Tolerance: +/-5%; Voltage Rating DC: 50 VDC; ComponentLink2Description: Datasheet; ComponentLink2URL: https://product.tdk.com/system/files/dam/doc/product/capacitor/ceramic/mlcc/catalog/mlcc_automotive_hightemp_en.pdf?ref_disty=mouser; Operating Temperature: -55 to +125degC; Packaging: Tape and Reel; Mounting Technology: SMT; Size: 0603; Supplier 1 Name: Mouser; Supplier 1 SN: 810-CGA3E2NP01H220JA; Supplier 1 URL: https://www.mouser.com/ProductDetail/TDK/CGA3E2NP01H220J080AA?qs=xLDY6iXSiQbIDiPJq57tVA%3D%3D&utm_source=mouser-refine-download&utm_medium=file&utm_campaign=CGA3E2NP01H220J080AA&utm_content=TDK; Supplier 2 Name: Digi-Key; Supplier 2 SN: 445-12401-2-ND; Supplier 2 URL: https://www.digikey.com/en/products/detail/tdk-corporation/cga3e2np01h220j080aa/3949637; Supplier 3 Name: thegioiic; Supplier 3 SN: N/A; Supplier 3 URL: https://www.thegioiic.com/tu-gom-0603-22pf-50v; Value: 22 pF, 50 VDC; SUPPLIER NAME: JLCPCB; SUPPLIER SN: C388039; SUPPLIER URL: https://jlcpcb.com/partdetail/Walsin_TechCorp-0603N220G500CT/C388039
C18 = 0106034751010: CAP, size 0603, 4.7 uF, 10 VDC; Manufacture Name: Samsung Electro-Mechanics; Manufacture SN: CL10A475KP8NNWC; Capacitance: 4.7 uF; Tolerance: +/-10%; Voltage Rating DC: 10 VDC; ComponentLink2Description: Datasheet; ComponentLink2URL: https://www.mouser.vn/datasheet/2/585/Samsung_MLCC_1837944-1929650.pdf; Operating Temperature: -55 to +125degC; Packaging: Tape and Reel; Mounting Technology: SMT; Size: 0603; Supplier 1 Name: Mouser; Supplier 1 SN: 187-CL10A475KP8NNWC; Supplier 1 URL: https://www.mouser.vn/ProductDetail/Samsung-Electro-Mechanics/CL10A475KP8NNWC?qs=81r%252BiQLm7BQyXBb52PEUBA%3D%3D&utm_source=mouser-refine-download&utm_medium=file&utm_campaign=CL10A475KP8NNWC&utm_content=Samsung-Electro-Mechanics; Supplier 2 Name: Digi-Key; Supplier 2 SN: 1276-CL10A475KP8NNWCTR-ND; Supplier 2 URL: https://www.digikey.com/en/products/detail/samsung-electro-mechanics/cl10a475kp8nnwc/16572736; Supplier 3 Name: thegioiic; Supplier 3 SN: N/A; Supplier 3 URL: https://www.thegioiic.com/tu-gom-0603-4-7uf-25v; Value: 4.7 uF, 10 VDC; SUPPLIER NAME: JLCPCB; SUPPLIER SN: C961503; SUPPLIER URL: https://jlcpcb.com/partdetail/1041342-C0603B475K010T/C961503
C26 = 0106031031050: CAP, size 0603, 10 nF, 50 VDC; Manufacture Name: TDK; Manufacture SN: CGA3E2X8R1H103K080AA; Capacitance: 10 nF; Tolerance: +/-10%; Voltage Rating DC: 50 VDC; ComponentLink2Description: Datasheet; ComponentLink2URL: https://product.tdk.com/system/files/dam/doc/product/capacitor/ceramic/mlcc/catalog/mlcc_automotive_hightemp_en.pdf?ref_disty=mouser; Operating Temperature: -55 to +125degC; Packaging: Tape and Reel; Mounting Technology: SMT; Size: 0603; Supplier 1 Name: Mouser; Supplier 1 SN: 810-CGA3E2X8R1H103K; Supplier 1 URL: https://www.mouser.com/ProductDetail/TDK/CGA3E2X8R1H103K080AA?qs=NRhsANhppD89WrzFr8uamw%3D%3D&utm_source=mouser-refine-download&utm_medium=file&utm_campaign=CGA3E2X8R1H103K080AA&utm_content=TDK; Supplier 2 Name: Digi-Key; Supplier 2 SN: 445-5892-2-ND; Supplier 2 URL: https://www.digikey.com/en/products/detail/tdk-corporation/cga3e2x8r1h103k080aa/2443370; Supplier 3 Name: thegioiic; Supplier 3 SN: N/A; Supplier 3 URL: N/Ahttps://www.thegioiic.com/tu-gom-0603-10nf-50v; Value: 10 nF, 50 VDC; SUPPLIER NAME: JLCPCB; SUPPLIER SN: C513325; SUPPLIER URL: https://jlcpcb.com/partdetail/-06035C103K4T2A/C513325
C27 = 0106031051016: as C4 on sheet SelfDrivingCar_SCH_PowerBoard; ComponentLink2Description: Datasheet; ComponentLink2URL: https://www.mouser.vn/datasheet/2/585/Samsung_MLCC_1837944-1929650.pdf; Operating Temperature: -55 to +125degC; Packaging: Tape and Reel; Mounting Technology: SMT; Size: 0603; Supplier 1 Name: Mouser; Supplier 1 SN: 187-CL10B105KO8NNWC; Supplier 1 URL: https://www.mouser.vn/ProductDetail/Samsung-Electro-Mechanics/CL10B105KO8NNWC?qs=81r%252BiQLm7BT%252BXtc72qn1ug%3D%3D&utm_source=mouser-refine-download&utm_medium=file&utm_campaign=CL10B105KO8NNWC&utm_content=Samsung-Electro-Mechanics; Supplier 2 Name: Digi-Key; Supplier 2 SN: 1276-CL10B105KO8NNWCTR-ND; Supplier 2 URL: https://www.digikey.com/en/products/detail/samsung-electro-mechanics/cl10b105ko8nnwc/16572783; Supplier 3 Name: thegioiic; Supplier 3 SN: N/A; Supplier 3 URL: https://www.thegioiic.com/tu-gom-0603-1uf-16v; Value: 1 uF, 16 VDC; SUPPLIER NAME: JLCPCB; SUPPLIER SN: C76706; SUPPLIER URL: https://jlcpcb.com/partdetail/Tdk-CGA3E1X7R1C105KT0Y0N/C76706
D8 = 160603GreenClear: WL-SMCW SMT Mono-color Chip LED Waterclear, size 0603, Green, 3.2V, 140deg; Type: Clear; Color: Green; Size: 0603; ComponentLink1Description: Datasheet link; ComponentLink1URL: N/A; ComponentLink2Description: Supplier 1 URL; ComponentLink2URL: https://www.mouser.vn/ProductDetail/Wurth-Elektronik/150060GS75000?qs=LlUlMxKIyB0UYkq5lDO8nA%3D%3D; ComponentLink3Description: Supplier 2 URL; ComponentLink3URL: https://www.digikey.com/en/products/detail/liteon/LTST-C191KGKT/386835; ComponentLink4Description: Supplier 3 URL; ComponentLink4URL: https://www.thegioiic.com/led-xanh-la-0603-dan-smd-trong-suot; Supplier 1 Name: Mouser; Supplier 1 SN: 710-150060GS75000; Supplier 1 URL: https://www.mouser.vn/ProductDetail/Wurth-Elektronik/150060GS75000?qs=LlUlMxKIyB0UYkq5lDO8nA%3D%3D; Supplier 2 Name: Digi-Key; Supplier 2 SN: 160-1446-2-ND; Supplier 2 URL: https://www.digikey.com/en/products/detail/liteon/LTST-C191KGKT/386835; Supplier 3 Name: ICDayRoi; Supplier 3 SN: N/A; Supplier 3 URL: https://www.thegioiic.com/led-xanh-la-0603-dan-smd-trong-suot; Value: Green, 3.2V; SUPPLIER NAME: JLCPCB; SUPPLIER SN: *; SUPPLIER URL: *
D9 = 160603RedClear: WL-SMCW SMT Mono-color Chip LED Waterclear, size 0603, Red, 2V, 140deg; Type: Clear; Color: Red; Size: 0603; ComponentLink1Description: Datasheet link; ComponentLink1URL: N/A; ComponentLink2Description: Supplier 1 URL; ComponentLink2URL: https://www.mouser.vn/ProductDetail/Wurth-Elektronik/150060RS75000?qs=LlUlMxKIyB3QnmZ3fw%2FVCA%3D%3D; ComponentLink3Description: Supplier 2 URL; ComponentLink3URL: https://www.digikey.com/en/products/detail/liteon/LTST-C191KRKT/386837; ComponentLink4Description: Supplier 3 URL; ComponentLink4URL: https://www.thegioiic.com/led-do-0603-dan-smd-trong-suot; Supplier 1 Name: Mouser; Supplier 1 SN: 710-150060RS75000; Supplier 1 URL: https://www.mouser.vn/ProductDetail/Wurth-Elektronik/150060RS75000?qs=LlUlMxKIyB3QnmZ3fw%2FVCA%3D%3D; Supplier 2 Name: Digi-Key; Supplier 2 SN: 160-1447-2-ND; Supplier 2 URL: https://www.digikey.com/en/products/detail/liteon/LTST-C191KRKT/386837; Supplier 3 Name: ICDayRoi; Supplier 3 SN: N/A; Supplier 3 URL: https://www.thegioiic.com/led-do-0603-dan-smd-trong-suot; Value: Red, 2V; SUPPLIER NAME: JLCPCB; SUPPLIER SN: *; SUPPLIER URL: *
P2 = 61300411121: WR-PHD Pin Header, THT, pitch 2.54mm, Single Row, Vertical, 4p; Manufacturer: Wurth Elektronik; Pin Number: 4; Rated Current: 3A; Working Voltage: 250VAC; Withstanding Voltage: 500VAC; Contact Resistance: 20mOhm; Supply Name 1: Mouser; ComponentLink1Description: Manufacturer; ComponentLink1URL: http://www.we-online.de; ComponentLink2Description: Datasheet; ComponentLink2URL: https://www.we-online.com/catalog/datasheet/61300411121.pdf; Manufacturer Part Number: 61300411121; Published Date: May 2020; Pitch: 2.54mm; Operating Temperature: -40 to +105degC; Mounting Technology: THT; Packaging: Bag; Gender: Pin Header; Row Number: Single; Orientation: Vertical; ComponentLink3Description: Global Supply; ComponentLink3URL: https://www.we-online.com/en/components/products/PHD_2_54_THT_PIN_HEADER_6130XX11121?sq=61300411121#61300411121; ComponentLink4Description: Global Supply; ComponentLink4URL: https://www.mouser.vn/ProductDetail/Wurth-Elektronik/61300411121?qs=PhR8RmCirEYQcLLqXD8rAA%3D%3D; Supplier 1 Name: Mouser; Supplier 1 SN: 710-61300311121; Supplier 1 URL: https://www.mouser.vn/ProductDetail/Wurth-Elektronik/61300311121?qs=PhR8RmCirEYxRWFJzNKsUw%3D%3D; Supplier 2 Name: Digi-Key; Supplier 2 SN: N/A; Supplier 2 URL: N/A; Supplier 3 Name: thegioiic; Supplier 3 SN: N/A; Supplier 3 URL: N/A; SUPPLIER NAME: JLCPCB; SUPPLIER SN: *; SUPPLIER URL: *
P3 = 61300621121: WR-PHD Pin Header, THT, pitch 2.54mm, Dual Row, Vertical, 6p; Manufacturer: Wurth Elektronik; Pin Number: 6; Rated Current: 3A; Working Voltage: 250VAC; Withstanding Voltage: 500VAC; Contact Resistance: 20mOhm; Supply name 1: Mouser; ComponentLink1Description: Manufacturer; ComponentLink1URL: http://www.we-online.de; ComponentLink2Description: Datasheet; ComponentLink2URL: https://www.we-online.com/catalog/datasheet/61300621121.pdf; Manufacturer Part Number: 61300621121; Published Date: May 2020; Pitch: 2.54mm; Operating Temperature: -40 to +105degC; Mounting Technology: THT; Packaging: Bag; Gender: Pin Header; Row Number: Dual; Orientation: Vertical; ComponentLink3Description: Global Supply; ComponentLink3URL: https://www.we-online.com/en/components/products/PHD_2_54_THT_DUAL_PIN_HEADER_6130XX21121?sq=61300621121#61300621121; ComponentLink4Description: Global Supply; ComponentLink4URL: https://www.mouser.vn/ProductDetail/Wurth-Elektronik/61300621121?qs=PhR8RmCirEb94hrEcn0AQg%3D%3D; Supplier 1 Name: Mouser; Supplier 1 SN: 710-61300621121; Supplier 1 URL: https://www.mouser.vn/ProductDetail/Wurth-Elektronik/61300621121?qs=PhR8RmCirEb94hrEcn0AQg%3D%3D; Supplier 2 Name: Digi-Key; Supplier 2 SN: N/A; Supplier 2 URL: N/A; Supplier 3 Name: thegioiic; Supplier 3 SN: N/A; Supplier 3 URL: N/A; SUPPLIER NAME: JLCPCB; SUPPLIER SN: *; SUPPLIER URL: *
P4 = 61300311121: WR-PHD Pin Header, THT, pitch 2.54mm, Single Row, Vertical, 3p; Manufacturer: Wurth Elektronik; Pin Number: 3; Rated Current: 3A; Working Voltage: 250VAC; Withstanding Voltage: 500VAC; Contact Resistance: 20mOhm; Supply Name 1: Mouser; ComponentLink1Description: Manufacturer; ComponentLink1URL: http://www.we-online.de; ComponentLink2Description: Datasheet; ComponentLink2URL: https://www.we-online.com/catalog/datasheet/61300311121.pdf; Manufacturer Part Number: 61300311121; Published Date: May 2020; Pitch: 2.54mm; Operating Temperature: -40 to +105degC; Mounting Technology: THT; Packaging: Bag; Gender: Pin Header; Row Number: Single; Orientation: Vertical; ComponentLink3Description: Global Supply; ComponentLink3URL: https://www.mouser.vn/ProductDetail/Wurth-Elektronik/61300311121?qs=PhR8RmCirEYxRWFJzNKsUw%3D%3D; Supplier 1 Name: Mouser; Supplier 1 SN: 710-61300311121; Supplier 1 URL: https://www.mouser.vn/ProductDetail/Wurth-Elektronik/61300311121?qs=PhR8RmCirEYxRWFJzNKsUw%3D%3D; Supplier 2 Name: Digi-Key; Supplier 2 SN: N/A; Supplier 2 URL: N/A; Supplier 3 Name: thegioiic; Supplier 3 SN: N/A; Supplier 3 URL: N/A; SUPPLIER NAME: JLCPCB; SUPPLIER SN: *; SUPPLIER URL: *
R10 R11 = Resistor: ComponentLink1Description: URL; ComponentLink1URL: https://www.thegioiic.com/dien-tro-10-kohm-0603-1-; SUPPLIER NAME: JLCPCB; SUPPLIER SN: C2989345; SUPPLIER URL: https://jlcpcb.com/partdetail/3448768-TC0325D1002T5F/C2989345
R12-R18 = 0006031031: RES, size 0603, 10 KOhm, 1/4 W; Manufacture  Name: OEM; Resistance: 10 KOhm; Rated Power: 1/4 W; Resistance Tolerance: +/-1%; Size: 0603; Mounting Technology: SMT; Supplier 1 Name: Mouser; Supplier 1 SN: 755-ESR03EZPF1002; Supplier 2 Name: Digi-Key; Supplier 2 SN: RHM10KADTR-ND RHM10KADCT-ND RHM10KADDKR-ND; Supplier 1 URL: https://www.mouser.vn/ProductDetail/ROHM-Semiconductor/ESR03EZPF1002?qs=sGAEpiMZZMvdGkrng054t67Efho1F8r6CDeAsqwFse8%3D; Supplier 3 Name: thegioiic; Supplier 3 SN: N/A; Manufacture  SN: OEM; Value: 10 KOhm, 1/4 W; ComponentLink1Description: Datasheet link; ComponentLink1URL: https://fscdn.rohm.com/en/products/databook/datasheet/passive/resistor/chip_resistor/esr-e.pdf; ComponentLink2Description: Supplier 1 URL; ComponentLink2URL: N/A; ComponentLink3Description: Supplier 2 URL; ComponentLink3URL: https://www.digikey.com/en/products/detail/rohm-semiconductor/ESR03EZPF1002/1983429; ComponentLink4Description: Supplier 3 URL; ComponentLink4URL: N/A; Supplier 2 URL: https://www.digikey.com/en/products/detail/rohm-semiconductor/ESR03EZPF1002/1983429; SUPPLIER NAME: JLCPCB; SUPPLIER SN: C2989345; SUPPLIER URL: https://jlcpcb.com/partdetail/3448768-TC0325D1002T5F/C2989345
  R12-R16: Supplier 3 URL: https://www.thegioiic.com/dien-tro-10-kohm-0603-1-
  R17 R18: Supplier 3 URL: N/A
SW1 = Button Tactile 3x4x2.5mm: Button Tafctile 3x4x2.5 mm. 2 pin SMD; ComponentLink1Description: URL; ComponentLink1URL: https://www.thegioiic.com/nut-nhan-3x4mm-cao-2-5mm-2-chan-smd; SUPPLIER NAME: JLCPCB; SUPPLIER SN: *
U4 = STM32F103C8T6: ARM Microcontrollers - MCU 32BIT Cortex M3 64KB 20KB RAM 2X12 ADC; Manufacturer: STM; Manufacture SN: STM32F103C8T6TR; Pad count: 48; ComponentLink1Description: Datasheet; Part Number: STM32F103C8T6; Value: STM32F103C8T6; ComponentLink1URL: https://www.mouser.com/datasheet/2/389/stm32f103c8-1851025.pdf; Footprint name: LQFP48; ComponentLink2Description: Supplier 1 URL; ComponentLink2URL: https://www.mouser.com/ProductDetail/STMicroelectronics/STM32F103C8T6?qs=bhCVus9SdFtq6kqxsU5%2FDA%3D%3D; ComponentLink3Description: Supplier 2 URL; ComponentLink3URL: 497-17666-2-ND; ComponentLink4Description: Supplier 3 URL; ComponentLink4URL: https://www.thegioiic.com/stm32f103c8t6-32-bit-arm-cortex-m3-microcontroller-72mhz-64kb-flash-48-lqfp; Supplier 1 Name: Mouser; Supplier 1 SN: 511-STM32F103C8T6; Supplier 1 URL: https://www.mouser.com/ProductDetail/STMicroelectronics/STM32F103C8T6?qs=bhCVus9SdFtq6kqxsU5%2FDA%3D%3D; Supplier 2 Name: Digi-Key; Supplier 2 SN: 497-17666-2-ND; Supplier 2 URL: https://www.digikey.com/en/products/detail/stmicroelectronics/stm32f103c8t6tr/2122442; Supplier 3 Name: thegioiic; Supplier 3 SN: STM32F103C8T6; Supplier 3 URL: https://www.thegioiic.com/stm32f103c8t6-32-bit-arm-cortex-m3-microcontroller-72mhz-64kb-flash-48-lqfp; SUPPLIER NAME: JLCPCB; SUPPLIER SN: C8734; SUPPLIER URL: https://jlcpcb.com/partdetail/Stmicroelectronics-STM32F103C8T6/C8734
Y1 = Crystal 4pin: ComponentLink1Description: URL; ComponentLink1URL: https://www.thegioiic.com/thach-anh-8mhz-3225-4-chan-smd; SUPPLIER NAME: JLCPCB; SUPPLIER SN: C518156; SUPPLIER URL: https://jlcpcb.com/partdetail/534693-3225_8_00_20_10_10A/C518156

## Sheet SelfDrivingCar_SCH_MotorDriver.SchDoc
size A; DocumentNumber: 6; SheetNumber: 5; SheetTotal: 7
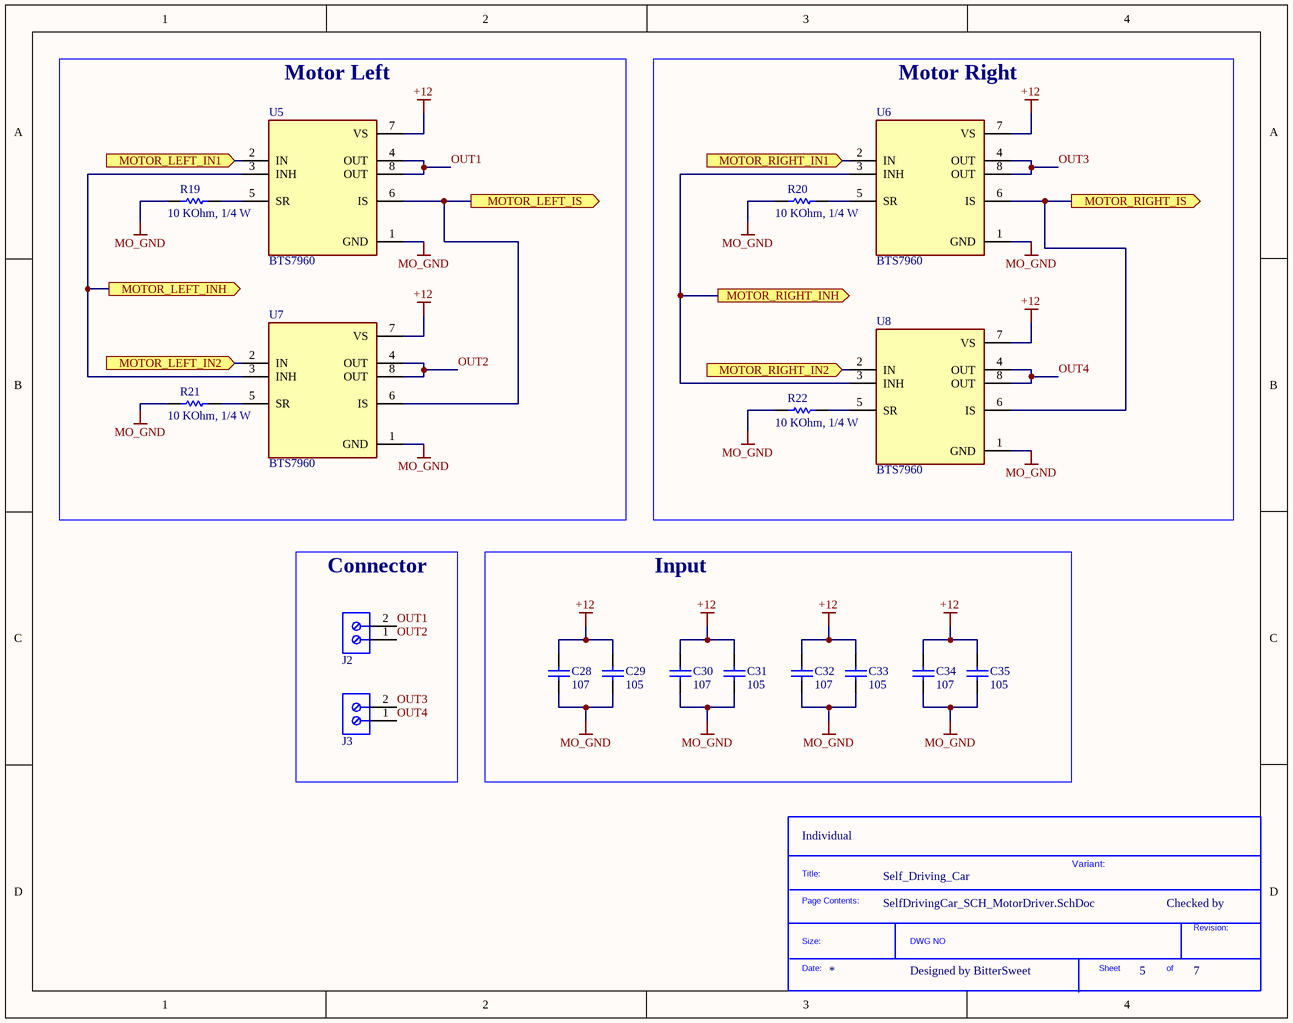
[diagram p3: SelfDrivingCar_SCH_MotorDriver.SchDoc]

### Parts
(Parts that share a designator on the sheet are numbered #1, #2 ... from top to bottom, then left to right.)
*?#4  SDTitleBlock  (value not drawn)  (graphical)
C28  107  [tu 1206]
C29  105  [tu 1206]
C30  107  [tu 1206]
C31  105  [tu 1206]
C32  107  [tu 1206]
C33  105  [tu 1206]
C34  107  [tu 1206]
C35  105  [tu 1206]
J2  16A, 300V  [691213710002]  (value not drawn)
J3  16A, 300V  [691213710002]  (value not drawn)
R19  10 KOhm, 1/4 W  [resistor_0603]
R20  10 KOhm, 1/4 W  [resistor_0603]
R21  10 KOhm, 1/4 W  [resistor_0603]
R22  10 KOhm, 1/4 W  [resistor_0603]
U5  BTS7960  [P-TO-263-7]
U6  BTS7960  [P-TO-263-7]
U7  BTS7960  [P-TO-263-7]
U8  BTS7960  [P-TO-263-7]

### Blocks framed on the sheet
Motor Left: R19 R21 U5 U7
Motor Right: R20 R22 U6 U8
Connector: J2 J3
Input: C28-C35

### Ports
MOTOR_LEFT_IN1 (in), MOTOR_LEFT_IN2 (in), MOTOR_LEFT_INH (out), MOTOR_LEFT_IS (out), MOTOR_RIGHT_IN1 (in), MOTOR_RIGHT_IN2 (in), MOTOR_RIGHT_INH (out), MOTOR_RIGHT_IS (out)

### Nets
+12: C28.1 C29.1 C30.1 C31.1 C32.1 C33.1 C34.1 C35.1 U5.7(VS) U6.7(VS) U7.7(VS) U8.7(VS)
MO_GND: C28.2 C29.2 C30.2 C31.2 C32.2 C33.2 C34.2 C35.2 R19.2 R20.2 R21.2 R22.2 U5.1(GND) U6.1(GND) U7.1(GND) U8.1(GND)
OUT1: J2.2 U5.4(OUT) U5.8(OUT)
OUT2: J2.1 U7.4(OUT) U7.8(OUT)
OUT3: J3.2 U6.4(OUT) U6.8(OUT)
OUT4: J3.1 U8.4(OUT) U8.8(OUT)
PA11: U5.6(IS) U7.6(IS) ; port MOTOR_LEFT_IS
PA12: U6.6(IS) U8.6(IS) ; port MOTOR_RIGHT_IS
NetQ1_2: U5.3(INH) U7.3(INH) ; port MOTOR_LEFT_INH
NetQ2_2: U6.3(INH) U8.3(INH) ; port MOTOR_RIGHT_INH
NetR19_1: R19.1 U5.5(SR)
NetR20_1: R20.1 U6.5(SR)
NetR21_1: R21.1 U7.5(SR)
NetR22_1: R22.1 U8.5(SR)
NetU4_30: U7.2(IN) ; port MOTOR_LEFT_IN2
NetU4_31: U5.2(IN) ; port MOTOR_LEFT_IN1
NetU4_39: U6.2(IN) ; port MOTOR_RIGHT_IN1
NetU4_41: U8.2(IN) ; port MOTOR_RIGHT_IN2

### Notes on the sheet
- (near *?#4) Individual
- Self_Driving_Car
- Variant:
- Checked by
- Designed by BitterSweet
- (in symbol SDTitleBlock) Title:; Page Contents:; Revision:; Size:; DWG NO; Date:; Sheet; of

### Library data of the parts
C28 C30 C32 C34 = Tu 1206 106 16V 20%: Dán; Don_Vi: Con; So_Chan: 2; Ten_Linh_Kien: Tụ 1207 106-10uF 20% 16V; Ma_Hang: MH004541; Chung_Loai: Dán; Kieu_Chan: *; ComponentLink1Description: URL; ComponentLink1URL: https://www.thegioiic.com/tu-gom-1206-10uf-16v; SUPPLIER NAME: JLCPCB; SUPPLIER SN: *; SUPPLIER URL: *
  C32: Parameter 1: *
C29 C31 C33 C35 = Tu 1206 105 50V 20%: Dán; Don_Vi: Con; So_Chan: 2; Ten_Linh_Kien: Tụ 1206 105-1uF 20% 50V; Ma_Hang: MH004545; Chung_Loai: Dán; Kieu_Chan: *; SUPPLIER NAME: JLCPCB; SUPPLIER SN: C141215; SUPPLIER URL: https://jlcpcb.com/partdetail/Kemet-C1206X105K5RAC7800/C141215
J2 J3 = 691213710002: WR-TBL Series 213 Horizontal Entry Modular, THT, pitch 5mm, 2p; Manufacturer: Wurth Elektronik; Modularity: Yes; Rated Current: 10A; ComponentLink1Description: Datasheet Link; ComponentLink1URL: https://www.we-online.com/redexpert/spec/691213710002?ad; ComponentLink2Description: Supplier 1 URL; ComponentLink2URL: N/A; Manufacturer Part Number: 691213710002; Category: Terminal Blocks; Match Code: WR-TBL; Mount: Through Hole; Operating Temperature Max: 105°C; Operating Temperature Min: -40°C; Packaging: Box; Application: Rising Cage Clamp; Number of Pins: 2; Number of Rows: 1; Orientation: Horizontal; Pitch: 5mm; Working Voltage: 300V; ComponentLink3Description: Supplier 2 URL; ComponentLink3URL: N/A; ComponentLink4Description: Supplier 3 URL; ComponentLink4URL: https://www.thegioiic.com/kf128-2-v-domino-2-chan-thang-5mm-300v-10a-han-pcb-loai-tot; Supplier 1 Name: Mouser; Supplier 1 SN: N/A; Supplier 1 URL: N/A; Supplier 2 Name: Digi-Key; Supplier 2 SN: N/A; Supplier 2 URL: N/A; Supplier 3 Name: thegioiic; Supplier 3 SN: N/A; Supplier 3 URL: https://www.thegioiic.com/kf128-2-v-domino-2-chan-thang-5mm-300v-10a-han-pcb-loai-tot; Value: 16A, 300V; SUPPLIER SN: *; SUPPLIER NAME: JLCPCB; SUPPLIER URL: *
R19-R22 = 0006031031: as R12 on sheet SelfDrivingCar_SCH_STM32F103C8T6; Size: 0603; Mounting Technology: SMT; Supplier 1 Name: Mouser; Supplier 1 SN: 755-ESR03EZPF1002; Supplier 2 Name: Digi-Key; Supplier 2 SN: RHM10KADTR-ND RHM10KADCT-ND RHM10KADDKR-ND; Supplier 1 URL: https://www.mouser.vn/ProductDetail/ROHM-Semiconductor/ESR03EZPF1002?qs=sGAEpiMZZMvdGkrng054t67Efho1F8r6CDeAsqwFse8%3D; Supplier 3 Name: thegioiic; Supplier 3 SN: N/A; Supplier 3 URL: N/A; Manufacture  SN: OEM; Value: 10 KOhm, 1/4 W; ComponentLink1Description: Datasheet link; ComponentLink1URL: https://fscdn.rohm.com/en/products/databook/datasheet/passive/resistor/chip_resistor/esr-e.pdf; ComponentLink2Description: Supplier 1 URL; ComponentLink2URL: N/A; ComponentLink3Description: Supplier 2 URL; ComponentLink3URL: https://www.digikey.com/en/products/detail/rohm-semiconductor/ESR03EZPF1002/1983429; ComponentLink4Description: Supplier 3 URL; ComponentLink4URL: N/A; Supplier 2 URL: https://www.digikey.com/en/products/detail/rohm-semiconductor/ESR03EZPF1002/1983429; SUPPLIER NAME: JLCPCB; SUPPLIER SN: C2989345; SUPPLIER URL: https://jlcpcb.com/partdetail/3448768-TC0325D1002T5F/C2989345
U6 = BTS7960: IC Control motor; SUPPLIER NAME: JLCPCB; SUPPLIER SN: *; SUPPLIER URL: *
U5 U7 U8 = BTS7960: ComponentLink1Description: URL; ComponentLink1URL: https://www.thegioiic.com/bts7960-ic-dieu-khien-dong-co-dc-27-5v-40a-to-263-7; SUPPLIER NAME: JLCPCB; SUPPLIER SN: *; SUPPLIER URL: *